# EasyEDA Pro project mobile_detector_new.eprj

# Schematic mobile detector
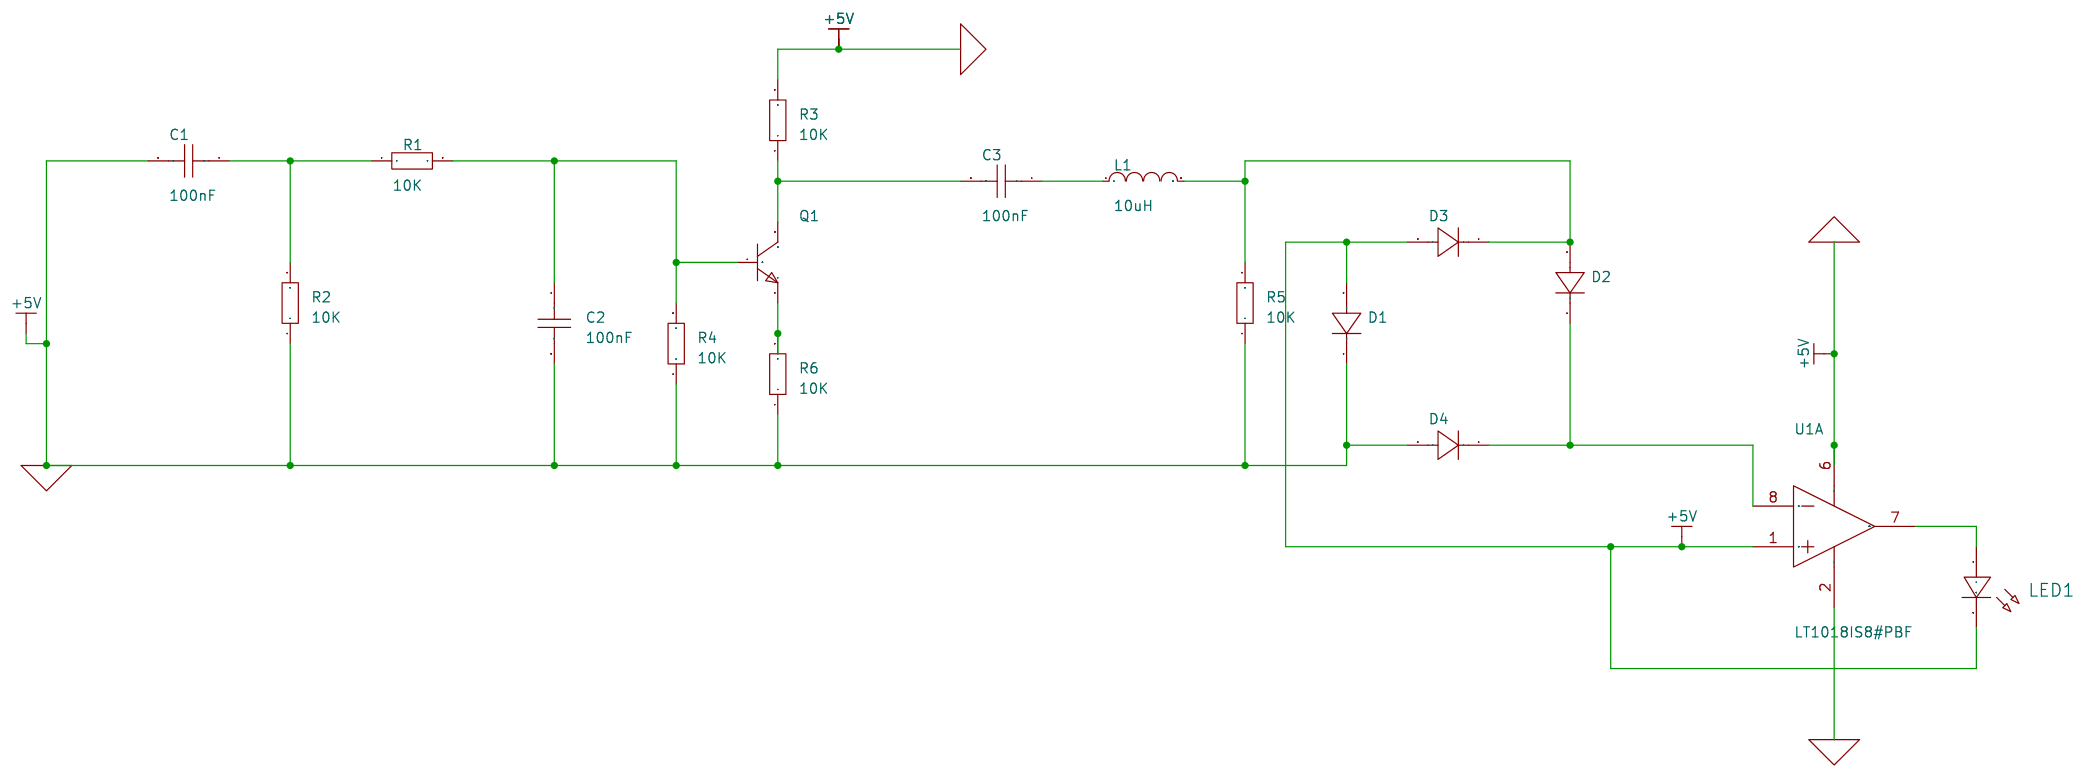
[diagram p0: schematic sheet]

## Parts
C1  100nF  [C0603]
C2  100nF  [C0603]
C3  100nF  [C0603]
D1  -  [DO-41_BD2.4-L4.7-P8.70-D0.9-RD]
D2  -  [DO-41_BD2.4-L4.7-P8.70-D0.9-RD]
D3  -  [DO-41_BD2.4-L4.7-P8.70-D0.9-RD]
D4  -  [DO-41_BD2.4-L4.7-P8.70-D0.9-RD]
L1  10uH  [L0402]
LED1  -  [LED0402-RD_YELLOW]
Q1  -  [SOT-23_L2.9-W1.3-P1.90-LS2.4-BR]
R1  10K  [R0603]
R2  10K  [R0603]
R3  10K  [R0603]
R4  10K  [R0603]
R5  10K  [R0603]
R6  10K  [R0603]
U1  LT1018IS8#PBF  [SO-8_L4.9-W3.9-P1.27-LS5.9-BL]  (section 1)

## Library data of the parts
C1-C3 = CAP_0603: Supplier Footprint: 0603
D1-D4 = 1N4007: Supplier Footprint: DO-41
L1 = L_0402
LED1 = LED_0402-R: Supplier Footprint: 0402
Q1 = S8050_NPN: Supplier Footprint: SOT-23
R1-R6 = Res_0603: Supplier Footprint: 0603
U1 = LT1018IS8#PBF: Supplier Part: C661516; Manufacturer: ADI(亚德诺); Supplier Footprint: SO-8; JLCPCB Part Class: Extended Part; Datasheet: https://atta.szlcsc.com/upload/public/pdf/source/20200628/C661962_5B9B30A71816784A516CF3DD1B759A69.pdf; Supplier: LCSC; Input Offset Voltage (Vos): 1mV; Input Bias Current (Ib): 0.075uA; Common Mode Rejection Ratio (CMRR): 115dB; Supply Voltage: 1.1V~40V；0.55V~20V; Operating Temperature: -40℃~+85℃

## Nets
+5V: C1.2 C2.2 D1.1(K) D1.2(A) D3.2(A) D4.2(A) LED1.2(C) R2.1 R3.2 R4.1 R5.1 R6.1 U1.1(INA+) U1.6(V+)
0: U1.2(V-)
$1N4: C1.1 R1.1 R2.2
$1N5: C2.1 Q1.1(B) R1.2 R4.2
$1N6: D2.2(A) D3.1(K) L1.2 R5.2
$1N7: C3.2 Q1.3(C) R3.1
$1N8: C3.1 L1.1
$1N11: Q1.2(E) R6.2
$1N13: D2.1(K) D4.1(K) U1.8(INA-)
$1N1290: LED1.1(A) U1.7(OUTA)

# Board PCB1
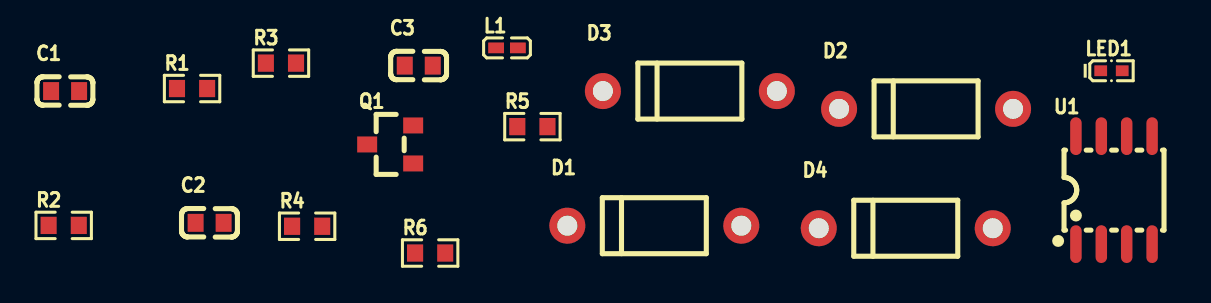
[diagram p1: board, top side]
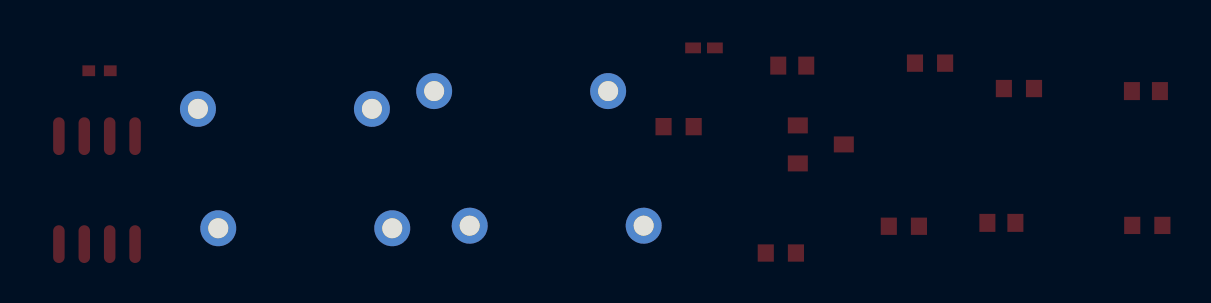
[diagram p2: board, bottom side, seen from below]

No outline. copper layers: Top Layer, Bottom Layer. Coordinates in mm from the lowest, leftmost part position.
Stack: Top Layer 0.035mm / Dielectric1 1.51mm FR4 er 4.5 / Bottom Layer 0.035mm

## Design rules (mm)
template: JLCPCB Capability(Two Layers Board)
spacing copperThickness1oz (default): track to track 0.102, other pairs 0.152 to 0.3
spacing copperThickness2oz: track to track 0.203, other pairs 0.152 to 0.3
track width copperThickness1oz (default): min 0.127, default 0.254, max 2.54
track width copperThickness2oz: min 0.203, default 0.254, max 2.54
differential pair differentialPair (default): width min 0.127, default 0.254, max 2.54; gap min 0.152, default 0.152
via viaSize (default): diameter min 0.5, default 0.61, max 10; hole min 0.3, default 0.305, max 6.3

## Placement (name value [footprint] x y rotation side)
C1  100nF  [C0603]  0.07 8.1 0 top
C2  100nF  [C0603]  7.3 1.51 0 top
C3  100nF  [C0603]  17.75 9.37 0 top
D1  -  [DO-41_BD2.4-L4.7-P8.70-D0.9-RD]  29.53 1.37 0 top
D2  -  [DO-41_BD2.4-L4.7-P8.70-D0.9-RD]  43.12 7.21 0 top
D3  -  [DO-41_BD2.4-L4.7-P8.70-D0.9-RD]  31.31 8.1 0 top
D4  -  [DO-41_BD2.4-L4.7-P8.70-D0.9-RD]  42.11 1.24 0 top
L1  10uH  [L0402]  22.17 10.26 0 top
LED1  -  [LED0402-RD_YELLOW]  52.39 9.11 0 top
Q1  -  [SOT-23_L2.9-W1.3-P1.90-LS2.4-BR]  16.32 5.43 0 top
R1  10K  [R0603]  6.42 8.22 0 top
R2  10K  [R0603]  0 1.38 0 top
R3  10K  [R0603]  10.86 9.49 0 top
R4  10K  [R0603]  12.17 1.34 0 top
R5  10K  [R0603]  23.44 6.32 0 top
R6  10K  [R0603]  18.32 0 0 top
U1  LT1018IS8#PBF  [SO-8_L4.9-W3.9-P1.27-LS5.9-BL]  52.52 3.14 0 top

## Footprints (pads in the part's own frame, mm; a bottom-side part is the same pattern mirrored in y, then rotated)
C0603
  rect 0.8x0.9 smd: 1(-0.7,0) 2(0.7,0)
DO-41_BD2.4-L4.7-P8.70-D0.9-RD
  round 1.8 hole 1: 1(-4.35,0) 2(4.35,0)
L0402
  rect 0.79x0.54 smd: 1(-0.545,0) 2(0.545,0)
LED0402-RD_YELLOW
  rect 0.636x0.54 smd: 1(-0.538,0) 2(0.538,0)
R0603
  rect 0.806x0.864 smd: 1(-0.753,0) 2(0.753,0)
SO-8_L4.9-W3.9-P1.27-LS5.9-BL
  oval 0.574x1.888 smd: 1(-1.905,-2.699) 2(-0.635,-2.699) 3(0.635,-2.699) 4(1.905,-2.699) 5(1.905,2.699) 6(0.635,2.699) 7(-0.635,2.699) 8(-1.905,2.699)
SOT-23_L2.9-W1.3-P1.90-LS2.4-BR
  rect 1x0.8 smd: 1(1.15,-0.95) 2(1.15,0.95) 3(-1.15,0)

## Nets
As in the schematic.

Pads without a net: U1 3 4 5
